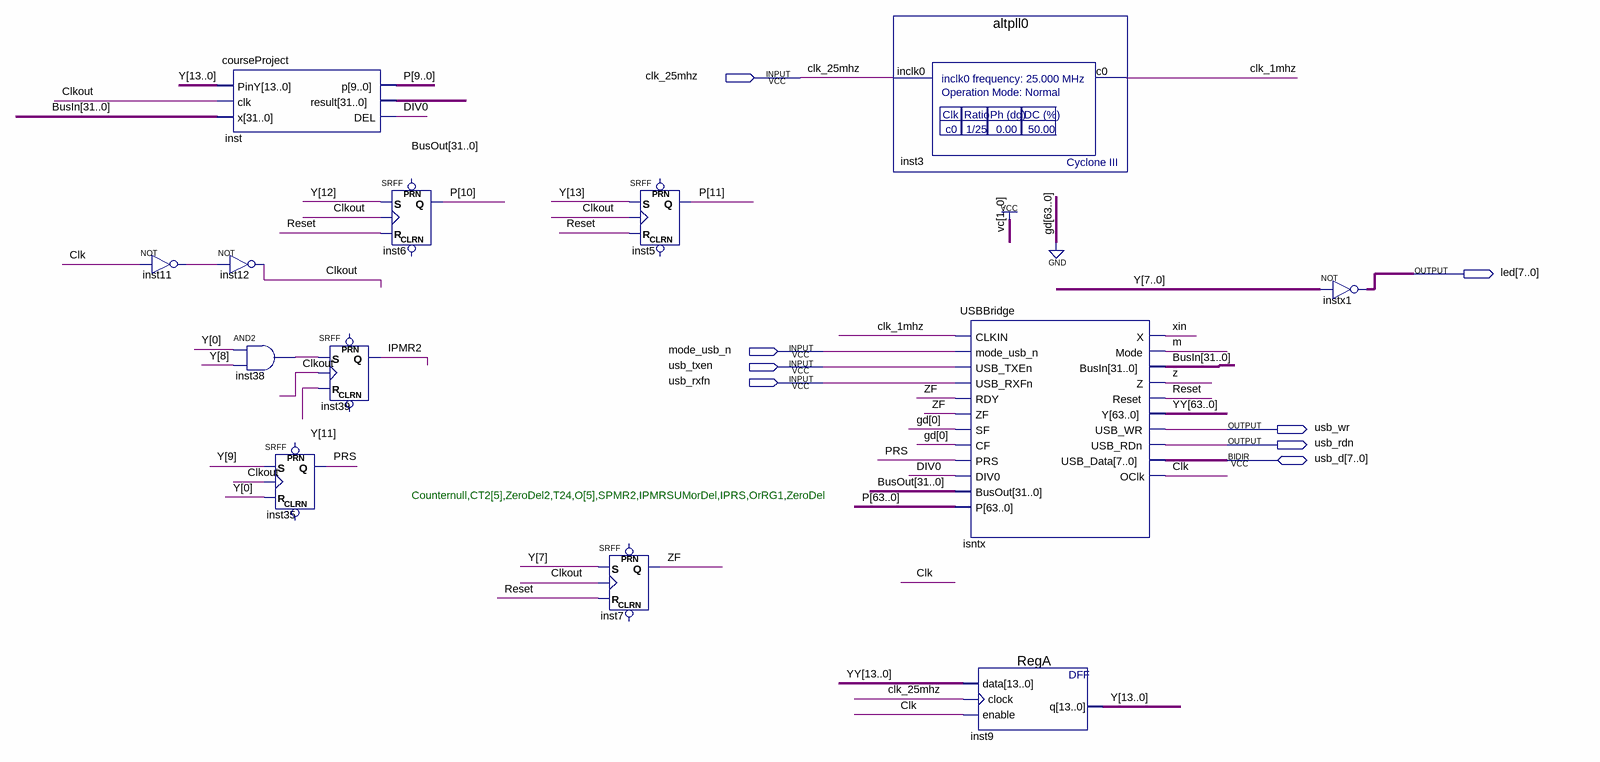
[diagram p0: schematic sheet]
// Quartus schematic Laba3_3oper.bdf as structural Verilog: 13 symbols, 8 pins
module Laba3_3oper (
  input  clk_25mhz,
  input  mode_usb_n,
  input  usb_txen,
  input  usb_rxfn,
  inout  [7:0] usb_d,
  output [7:0] led,
  output usb_wr,
  output usb_rdn
);

  wire Clk, clk_1mhz, Clkout, DIV0, inst11_out, inst38_out, IPMR2, m, PRS, Reset, xin, z, ZF;
  wire [13:0] Y;
  wire [31:0] BusIn, BusOut;
  wire [63:0] P, YY;

  not inst11 (inst11_out, Clk);
  courseProject inst (.PinY(Y), .clk(Clkout), .x(BusIn), .p(P[9:0]), .result(BusOut), .DEL(DIV0));
  not inst12 (Clkout, inst11_out);
  and inst38 (inst38_out, Y[0], Y[8]);
  SRFF inst35 (.S(Y[9]), .R(Y[0]), .CLK(Clkout), .Q(PRS));  // open: PRN, CLRN
  SRFF inst39 (.S(inst38_out), .R(Y[11]), .CLK(Clkout), .Q(IPMR2));  // open: PRN, CLRN
  SRFF inst6 (.S(Y[12]), .R(Reset), .CLK(Clkout), .Q(P[10]));  // open: PRN, CLRN
  SRFF inst7 (.S(Y[7]), .R(Reset), .CLK(Clkout), .Q(ZF));  // open: PRN, CLRN
  SRFF inst5 (.S(Y[13]), .R(Reset), .CLK(Clkout), .Q(P[11]));  // open: PRN, CLRN
  altpll0 inst3 (.inclk0(clk_25mhz), .c0(clk_1mhz));
  USBBridge isntx (
    .CLKIN(clk_1mhz), .mode_usb_n(mode_usb_n), .USB_TXEn(usb_txen), .USB_RXFn(usb_rxfn), .RDY(ZF), .ZF(ZF),
    .SF(1'b0), .CF(1'b0), .PRS(PRS), .DIV0(DIV0), .BusOut(BusOut), .P(P), .X(xin), .Mode(m), .BusIn(BusIn),
    .Z(z), .Reset(Reset), .Y(YY), .USB_WR(usb_wr), .USB_RDn(usb_rdn), .OClk(Clk), .USB_Data(usb_d));
  RegA inst9 (.data(YY[13:0]), .clock(clk_25mhz), .enable(Clk), .q(Y));
  assign led = ~Y[7:0];  // NOT instx1, 8 bits wide

  // Notes on the sheet:
  //   Counternull,CT2[5],ZeroDel2,T24,O[5],SPMR2,IPMRSUMorDel,IPRS,OrRG1,ZeroDel
endmodule
